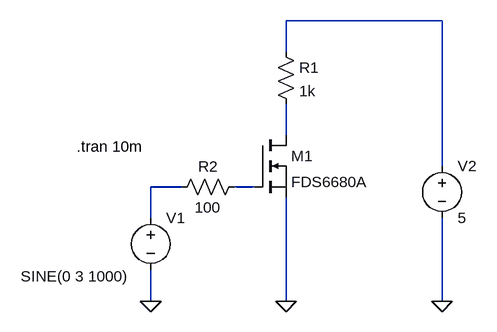
[diagram p0: schematic fds6680a.asc]
fds6680a.asc, the LTspice schematic file:
Version 4
SHEET 1 880 680
WIRE -128 256 -128 304
WIRE -128 384 -128 432
WIRE 80 272 80 432
WIRE 80 176 80 128
WIRE 80 48 80 0
WIRE 320 304 320 432
WIRE 0 256 32 256
WIRE -80 256 -128 256
WIRE 80 0 320 0
WIRE 320 0 320 224
FLAG -128 432 0
FLAG 80 432 0
FLAG 320 432 0
SYMBOL voltage -128 288 R0
WINDOW 123 0 0 Left 0
WINDOW 39 0 0 Left 0
WINDOW 3 -200 106 Left 0
SYMATTR InstName V1
SYMATTR Value SINE(0 3 1000)
SYMBOL res 64 32 R0
SYMATTR InstName R1
SYMATTR Value 1k
SYMBOL voltage 320 208 R0
WINDOW 123 0 0 Left 0
WINDOW 39 0 0 Left 0
SYMATTR InstName V2
SYMATTR Value 5
SYMBOL nmos 32 176 R0
SYMATTR InstName M1
SYMATTR Value FDS6680A
SYMBOL res -96 272 R270
WINDOW 0 32 56 VTop 0
WINDOW 3 0 56 VBottom 0
SYMATTR InstName R2
SYMATTR Value 100
TEXT -242 194 Left 0 !.tran 10m

The netlist it stands for:
* fds6680a.asc
V1 N001 0 SINE(0 3 1000)
R1 N003 N002 1k
V2 N003 0 5
M1 N002 N004 0 0 FDS6680A
R2 N001 N004 100
.model NMOS NMOS
.model PMOS PMOS
.lib standard.mos
.tran 10m
.backanno
.end